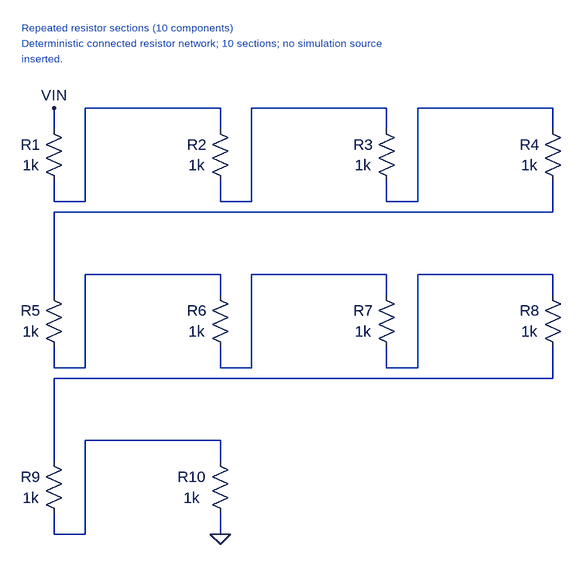
[diagram p0: schematic circuit.asc]
circuit.asc, the LTspice schematic file:
Version 4
SHEET 1 912 880
SYMBOL res 64 128 R0
WINDOW 0 -20 40 Center 2
WINDOW 3 -20 72 Center 2
SYMATTR InstName R1
SYMATTR Value 1k
SYMBOL res 320 128 R0
WINDOW 0 -20 40 Center 2
WINDOW 3 -20 72 Center 2
SYMATTR InstName R2
SYMATTR Value 1k
SYMBOL res 576 128 R0
WINDOW 0 -20 40 Center 2
WINDOW 3 -20 72 Center 2
SYMATTR InstName R3
SYMATTR Value 1k
SYMBOL res 832 128 R0
WINDOW 0 -20 40 Center 2
WINDOW 3 -20 72 Center 2
SYMATTR InstName R4
SYMATTR Value 1k
SYMBOL res 64 384 R0
WINDOW 0 -20 40 Center 2
WINDOW 3 -20 72 Center 2
SYMATTR InstName R5
SYMATTR Value 1k
SYMBOL res 320 384 R0
WINDOW 0 -20 40 Center 2
WINDOW 3 -20 72 Center 2
SYMATTR InstName R6
SYMATTR Value 1k
SYMBOL res 576 384 R0
WINDOW 0 -20 40 Center 2
WINDOW 3 -20 72 Center 2
SYMATTR InstName R7
SYMATTR Value 1k
SYMBOL res 832 384 R0
WINDOW 0 -20 40 Center 2
WINDOW 3 -20 72 Center 2
SYMATTR InstName R8
SYMATTR Value 1k
SYMBOL res 64 640 R0
WINDOW 0 -20 40 Center 2
WINDOW 3 -20 72 Center 2
SYMATTR InstName R9
SYMATTR Value 1k
SYMBOL res 320 640 R0
WINDOW 0 -28 40 Center 2
WINDOW 3 -28 72 Center 2
SYMATTR InstName R10
SYMATTR Value 1k
WIRE 80 112 80 144
WIRE 80 224 80 256
WIRE 80 256 128 256
WIRE 80 272 80 400
WIRE 80 272 848 272
WIRE 80 480 80 512
WIRE 80 512 128 512
WIRE 80 528 80 656
WIRE 80 528 848 528
WIRE 80 736 80 768
WIRE 80 768 128 768
WIRE 128 112 128 256
WIRE 128 112 336 112
WIRE 128 368 128 512
WIRE 128 368 336 368
WIRE 128 624 128 768
WIRE 128 624 336 624
WIRE 336 112 336 144
WIRE 336 224 336 256
WIRE 336 256 384 256
WIRE 336 368 336 400
WIRE 336 480 336 512
WIRE 336 512 384 512
WIRE 336 624 336 656
WIRE 336 736 336 768
WIRE 384 112 384 256
WIRE 384 112 592 112
WIRE 384 368 384 512
WIRE 384 368 592 368
WIRE 592 112 592 144
WIRE 592 224 592 256
WIRE 592 256 640 256
WIRE 592 368 592 400
WIRE 592 480 592 512
WIRE 592 512 640 512
WIRE 640 112 640 256
WIRE 640 112 848 112
WIRE 640 368 640 512
WIRE 640 368 848 368
WIRE 848 112 848 144
WIRE 848 224 848 272
WIRE 848 368 848 400
WIRE 848 480 848 528
FLAG 336 768 0
FLAG 80 112 VIN
TEXT 30 -12 Left 1 ;Repeated resistor sections (10 components)
TEXT 30 12 Left 1 ;Deterministic connected resistor network; 10 sections; no simulation source
TEXT 30 36 Left 1 ;inserted.

The netlist it stands for:
* circuit.asc
R1 VIN N001 1k
R2 N001 N006 1k
R3 N006 N008 1k
R4 N008 N002 1k
R5 N002 N003 1k
R6 N003 N007 1k
R7 N007 N009 1k
R8 N009 N004 1k
R9 N004 N005 1k
R10 N005 0 1k
* Repeated resistor sections (10 components)
* Deterministic connected resistor network; 10 sections; no simulation source
* inserted.
.backanno
.end